# EAGLE design BlueHat2018 Ver 2.3A (EAGLE 7.6.0)
REV: 3
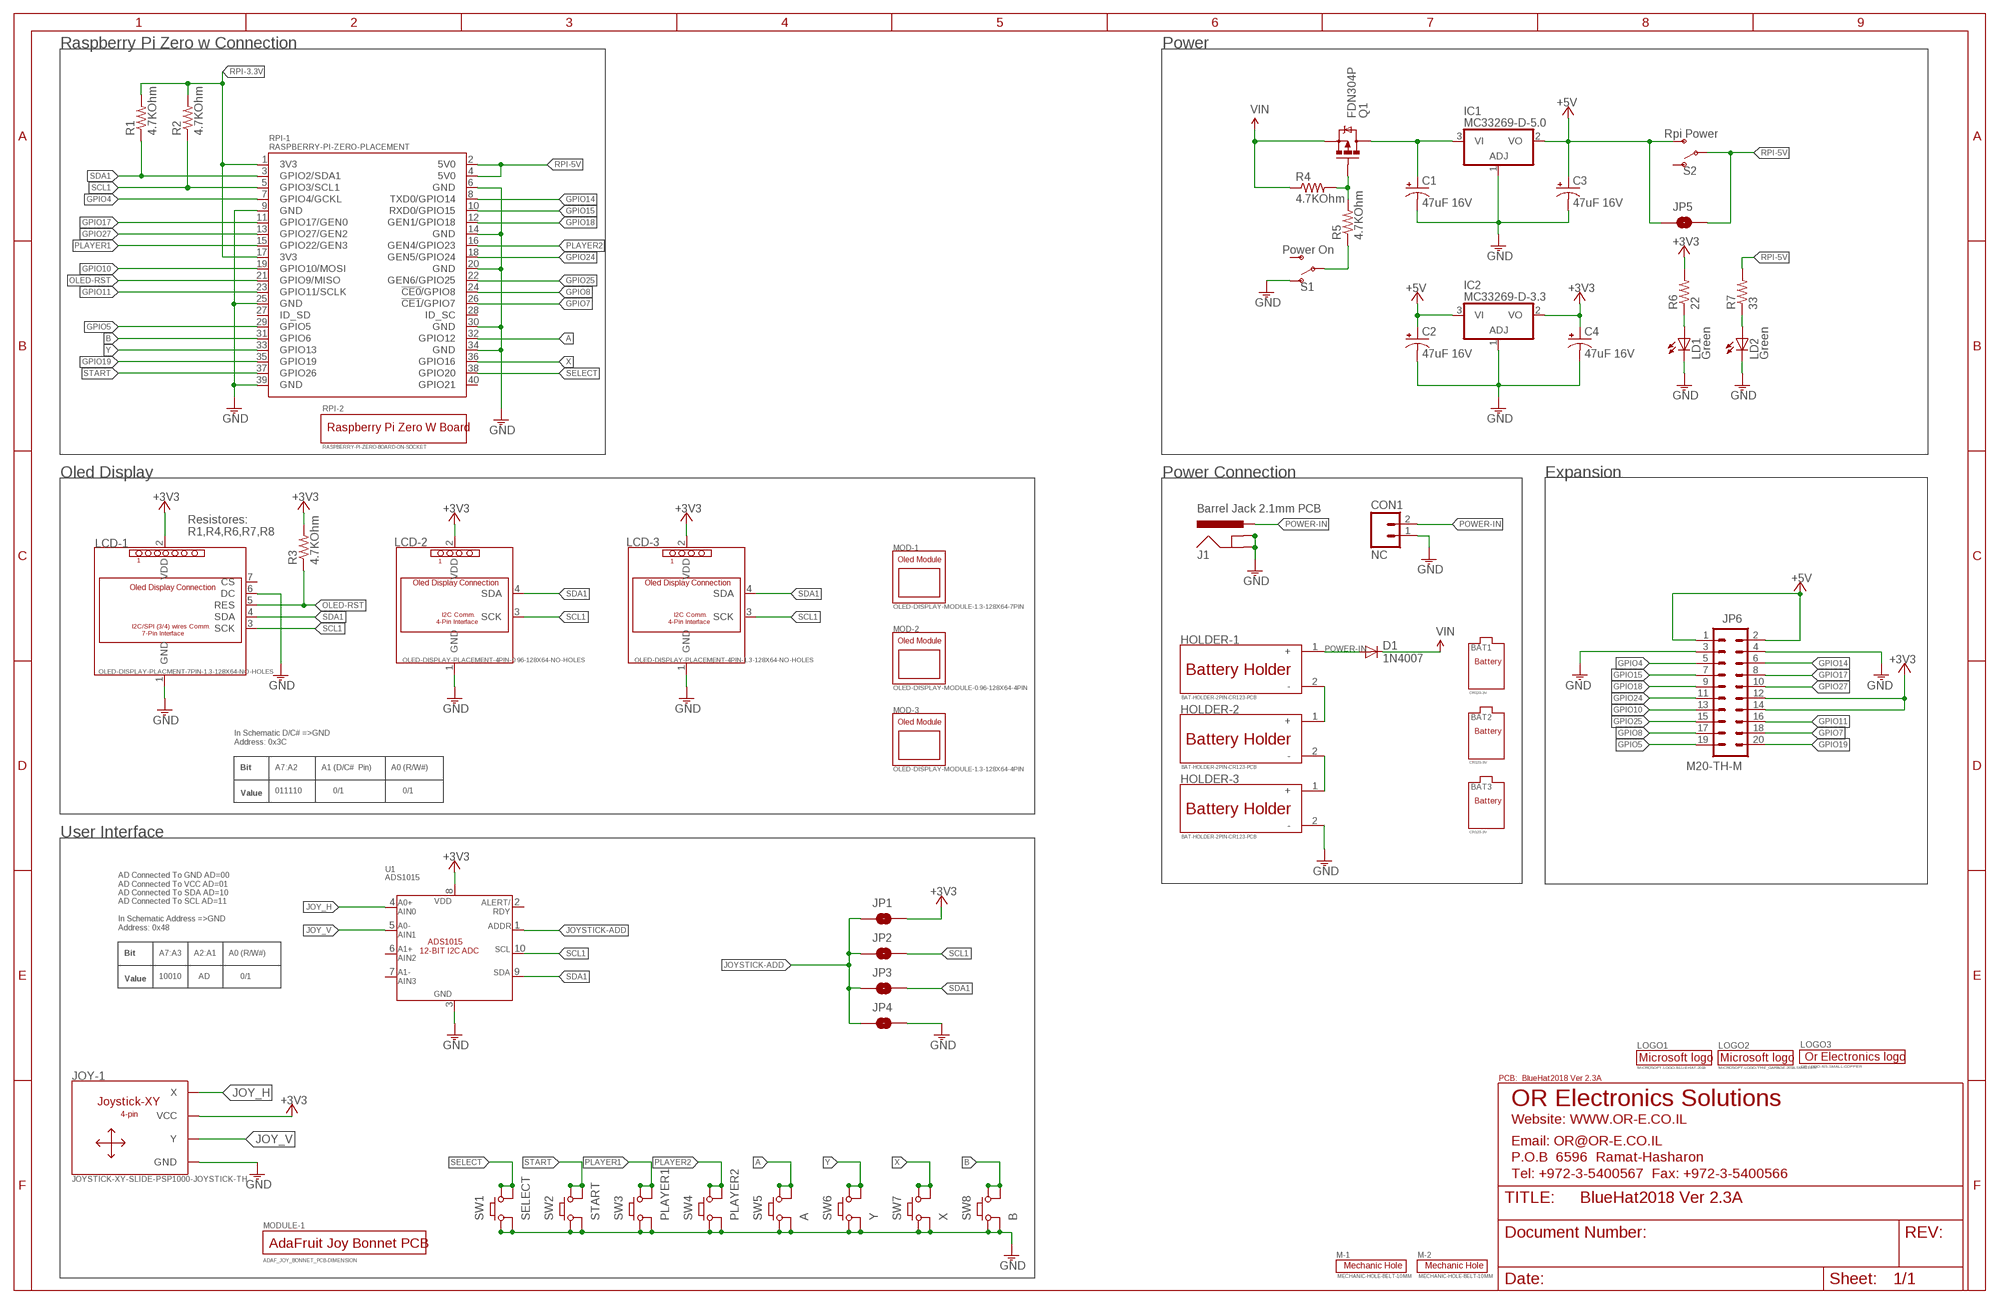
[diagram p0: schematic, sheet 1]

## Parts
BAT1  CR123-3V  BATTERY-CR123-3V  [CR123-BATTERY]
BAT2  CR123-3V  BATTERY-CR123-3V  [CR123-BATTERY]
BAT3  CR123-3V  BATTERY-CR123-3V  [CR123-BATTERY]
C1  47uF 16V  CAP_POLARIZEDD  [PANASONIC_D]
C2  47uF 16V  CAP_POLARIZEDD  [PANASONIC_D]
C3  47uF 16V  CAP_POLARIZEDD  [PANASONIC_D]
C4  47uF 16V  CAP_POLARIZEDD  [PANASONIC_D]
CON1  NC  M02-2PIN-MALE-2.54MM  [1X02-TH-M]
D1  1N4007  DIODEDO214AC  [DO214AC]
FRAME1  FRAME_B_L-TDOC  [PCB_DRAW_NAME_TDOC]
HOLDER-1  BAT-HOLDER-2PIN-CR123-PCB  [BAT-CR123-HOLDER]
HOLDER-2  BAT-HOLDER-2PIN-CR123-PCB  [BAT-CR123-HOLDER]
HOLDER-3  BAT-HOLDER-2PIN-CR123-PCB  [BAT-CR123-HOLDER]
IC1  MC33269-D-5.0  [DPACK]
IC2  MC33269-D-3.3  [DPACK]
J1  Barrel Jack 2.1mm PCB  POWER_JACKPTH_LOCK  [POWER_JACK_PTH_LOCK]
JOY-1  JOYSTICK-XY-SLIDE-PSP1000-JOYSTICK-TH  [JOYSTICK-PSP1000-TH]
JP1  JUMPER-2-POSITION-SMD-NO  [SJ_2S-NO]
JP2  JUMPER-2-POSITION-SMD-NO  [SJ_2S-NO]
JP3  JUMPER-2-POSITION-SMD-NO  [SJ_2S-NO]
JP4  JUMPER-2-POSITION-SMD-NC-TRACE-SMALL  [SJ_2S-TRACE-SMALL]
JP5  JUMPER-2-POSITION-SMD-NO  [SJ_2S-NO]
JP6  M20-TH-M  [2X10-TH-M]
LCD-1  OLED-DISPLAY-PLACMENT-7PIN-1.3-128X64-NO-HOLES  [OLED-1.3-7PIN-NO-HOLES]
LCD-2  OLED-DISPLAY-PLACEMENT-4PIN-0.96-128X64-NO-HOLES  [OLED-0.96-4PIN-NO-HOLES]
LCD-3  OLED-DISPLAY-PLACEMENT-4PIN-1.3-128X64-NO-HOLES  [OLED-1.3-4PIN-NO-HOLES]
LD1  Green  LED0603  [LD0603]
LD2  Green  LED0603  [LD0603]
LOGO1  MICROSOFT-LOGO-BLUEHAT-2018  [MICROSOFT_LOGO1_2018]
LOGO2  MICROSOFT-LOGO-THE_GARAGE-2018-SMALLER  [MICROSOFT_LOGO2_2018_SMALLER]
LOGO3  OR-LOGO-NS-SMALL-COPPER  [OR_LOGO-NS-SMALL-COPPER]
M-1  MECHANIC-HOLE-BELT-10MM  [BELT-10MM]
M-2  MECHANIC-HOLE-BELT-10MM  [BELT-10MM]
MOD-1  OLED-DISPLAY-MODULE-1.3-128X64-7PIN  [OLED-MODULE-1.3-128X64-7PIN]
MOD-2  OLED-DISPLAY-MODULE-0.96-128X64-4PIN  [OLED-MODULE-0.96-128X64-4PIN]
MOD-3  OLED-DISPLAY-MODULE-1.3-128X64-4PIN  [OLED-MODULE-1.3-128X64-4PIN]
MODULE-1  ADAF_JOY_BONNET_PCB-DIMENSION  [ADAF_JOY_BONNET_DIMENSION.]
Q1  FDN304P  MOSFET-PCHANNEL-SOT23  [SOT23]
R1  4.7KOhm  RESISTOR-SMD-0805  [R0805]
R2  4.7KOhm  RESISTOR-SMD-0805  [R0805]
R3  4.7KOhm  RESISTOR-SMD-0805  [R0805]
R4  4.7KOhm  RESISTOR-SMD-0805  [R0805]
R5  4.7KOhm  RESISTOR-SMD-0805  [R0805]
R6  22  RESISTOR-SMD-0805  [R0805]
R7  33  RESISTOR-SMD-0805  [R0805]
RPI-1  RASPBERRY-PI-ZERO-PLACEMENT  [RPI_ZERO_BOARD_PLACEMENT]
RPI-2  RASPBERRY-PI-ZERO-BOARD-ON-SOCKET  [RASPBERRY-PI-ZERO-BOARD-ON-SOCKET]
S1  Power On  SWITCH-SPDT-SSSS820201  [ALPS-SSSS820201]
S2  Rpi Power  SWITCH-SPDT-SSSS820201  [ALPS-SSSS820201]
SW1  SELECT  TAC_SWITCH-T.H.-6X6MM  [TACTILE-6X6-PTH]
SW2  START  TAC_SWITCH-T.H.-6X6MM  [TACTILE-6X6-PTH]
SW3  PLAYER1  TAC_SWITCH-T.H.-6X6MM  [TACTILE-6X6-PTH]
SW4  PLAYER2  TAC_SWITCH-T.H.-6X6MM  [TACTILE-6X6-PTH]
SW5  A  TAC_SWITCH-T.H.-6X6MM  [TACTILE-6X6-PTH]
SW6  Y  TAC_SWITCH-T.H.-6X6MM  [TACTILE-6X6-PTH]
SW7  X  TAC_SWITCH-T.H.-6X6MM  [TACTILE-6X6-PTH]
SW8  B  TAC_SWITCH-T.H.-6X6MM  [TACTILE-6X6-PTH]
U1  ADS1015  ADS1015-MSOP10  [MSOP10]

## Nets
+3V3 [power_1A]: C4.+ IC2.2(VO) JOY-1.VCC JOY-1.VCC@1(VCC) JP1.2 JP6.12 JP6.14 LCD-1.2(VDD) LCD-2.2(VDD) LCD-3.2(VDD) R3.2 R6.2 U1.8(VDD)
+5V [power_1A]: C2.+ C3.+ IC1.2(VO) IC2.3(VI) JP5.1 JP6.1 JP6.2 S2.3(T2)
A: RPI-1.32(GPIO12) SW5.3 SW5.4
B: RPI-1.31(GPIO6) SW8.3 SW8.4
GND: C1.- C2.- C3.- C4.- CON1.1 HOLDER-3.2(-) IC1.1(ADJ) IC2.1(ADJ) J1.GND J1.GNDBREAK JOY-1.GND JOY-1.GND@1(GND) JP4.2 JP6.3 JP6.4 LCD-1.1(GND) LCD-1.6(DC) LCD-2.1(GND) LCD-3.1(GND) LD1.C LD2.C S1.1(T1) SW1.1 SW1.2 SW2.1 SW2.2 SW3.1 SW3.2 SW4.1 SW4.2 SW5.1 SW5.2 SW6.1 SW6.2 SW7.1 SW7.2 SW8.1 SW8.2 U1.3(VSS)
GND@3: RPI-1.9(GND) RPI-1.25(GND) RPI-1.39(GND) ; supply symbol labelled GND
GND@7: RPI-1.6(GND) RPI-1.14(GND) RPI-1.20(GND) RPI-1.30(GND) RPI-1.34(GND) ; supply symbol labelled GND
GPIO4: JP6.5 RPI-1.7(GPIO4/GCKL)
GPIO5: JP6.19 RPI-1.29(GPIO5)
GPIO7: JP6.18 RPI-1.26(!CE1!/GPIO7)
GPIO8: JP6.17 RPI-1.24(!CE0!/GPIO8)
GPIO10: JP6.13 RPI-1.19(GPIO10/MOSI)
GPIO11: JP6.16 RPI-1.23(GPIO11/SCLK)
GPIO14: JP6.6 RPI-1.8(TXD0/GPIO14)
GPIO15: JP6.7 RPI-1.10(RXD0/GPIO15)
GPIO17: JP6.8 RPI-1.11(GPIO17/GEN0)
GPIO18: JP6.9 RPI-1.12(GEN1/GPIO18)
GPIO19: JP6.20 RPI-1.35(GPIO19)
GPIO24: JP6.11 RPI-1.18(GEN5/GPIO24)
GPIO25: JP6.15 RPI-1.22(GEN6/GPIO25)
GPIO27: JP6.10 RPI-1.13(GPIO27/GEN2)
JOY_H: JOY-1.X JOY-1.X@1(X) U1.4(AIN0)
JOY_V: JOY-1.Y JOY-1.Y@1(Y) U1.5(AIN1)
JOYSTICK-ADD: JP1.1 JP2.1 JP3.1 JP4.1 U1.1(ADDR)
N$1 [power_2A]: HOLDER-1.2(-) HOLDER-2.1(+)
N$2 [power_2A]: C1.+ IC1.3(VI) Q1.3(D)
N$3: Q1.1(G) R4.2 R5.2
N$4: LD1.A R6.1
N$5: LD2.A R7.1
N$6: R5.1 S1.2(P)
N$7 [power_2A]: HOLDER-2.2(-) HOLDER-3.1(+)
OLED-RST: LCD-1.5(RES) R3.1 RPI-1.21(GPIO9/MISO)
PLAYER1: RPI-1.15(GPIO22/GEN3) SW3.3 SW3.4
PLAYER2: RPI-1.16(GEN4/GPIO23) SW4.3 SW4.4
POWER-IN [power_2A]: CON1.2 D1.A HOLDER-1.1(+) J1.PWR
RPI-3.3V: R1.2 R2.2 RPI-1.1(3V3) RPI-1.17(3V3)
RPI-5V [power_1A]: JP5.2 R7.2 RPI-1.2(5V0) RPI-1.4(5V0) S2.2(P)
SCL1: JP2.2 LCD-1.3(SCK) LCD-2.3(SCK) LCD-3.3(SCK) R2.1 RPI-1.5(GPIO3/SCL1) U1.10(SCL)
SDA1: JP3.2 LCD-1.4(SDA) LCD-2.4(SDA) LCD-3.4(SDA) R1.1 RPI-1.3(GPIO2/SDA1) U1.9(SDA)
SELECT: RPI-1.38(GPIO20) SW1.3 SW1.4
START: RPI-1.37(GPIO26) SW2.3 SW2.4
VIN [power_2A]: D1.C Q1.2(S) R4.1
X: RPI-1.36(GPIO16) SW7.3 SW7.4
Y: RPI-1.33(GPIO13) SW6.3 SW6.4
Unconnected: LCD-1.7(CS) RPI-1.27(ID_SD) RPI-1.28(ID_SC) RPI-1.40(GPIO21) S1.3(T2) S2.1(T1) U1.2(ALERT/RDY) U1.6(AIN2) U1.7(AIN3)

## Notes on the sheet
- Raspberry Pi Zero w Connection | Power
- Oled Display | Power Connection | Expansion
- Resistores: 
  R1,R4,R6,R7,R8
- In Schematic D/C# =>GND
  Address: 0x3C
- Bit | A7:A2 | A1 (D/C#  Pin) | A0 (R/W#)
- 011110 | 0/1 | 0/1
- Value
- User Interface
- AD Connected To GND AD=00
  AD Connected To VCC AD=01
  AD Connected To SDA AD=10
  AD Connected To SCL AD=11
  
  In Schematic Address =>GND
  Address: 0x48
- Bit | A7:A3 | A2:A1 | A0 (R/W#)
- 10010 | AD | 0/1
- Value

## Library data of the parts
BAT1-BAT3 = Or-Library:BATTERY: Battery No Footprint for it
C1-C4 = Or-Library:CAP_POLARIZED: Capacitor Polarized These are standard SMD capacitors. Normally 10uF, 47uF, and 100uF in electrolytic and tantalum varieties. Always verify the external diameter of the through hole cap, it varies with capacity, voltage, and manufacturer. The EIA devices should be standard.
CON1 = Or-Library:M02: Header 2 Standard 2-pin 0.1" header. Use with straight break away headers (SKU : PRT-00116), right angle break away headers (PRT-00553), swiss pins (PRT-00743), machine pins (PRT-00117), and female headers (PRT-00115). Molex polarized connector foot print use with SKU : PRT-08233 with associated crimp pins and housings.
D1 = Or-Library:DIODE: DIODE
FRAME1 = Or-Library:FRAME_B_L: FRAME B Size , 11 x 17 INCH, Landscape
HOLDER-1-HOLDER-3 = Or-Library:BAT-HOLDER-2PIN: Battery Holder Holder For Battery
IC1 IC2 = Or-Library:MC33269?*: Adjustable Output Low Dropout Voltage Regulator 800 mA Source: http://www.onsemi.com/pub/Collateral/MC33269-D.PDF
J1 = Or-Library:POWER_JACK: Power Jack This is the standard 5.5mm barrel jack for power. The PTH is the most common, proven, reliable, footprint. All others are experimental. The Slot footprint only works if the mill layer is transmitted to the PCB fab house so be warned. Spark Fun Electronics SKU : PRT-00119. Mating wall wart : TOL-00298 (and others)
JOY-1 = Or-Library:JOYSTICK-XY-SLIDE: Resistive Slide Joystick Rresistive analog joystick
JP1-JP5 = Or-Library:JUMPER-2-POSITION: Jumper Basic spaced jumper SMD or TH please refer package type
JP6 = Or-Library:M20: Header 20pin Header with 20 connections Male/Female Please refer Package
LCD-1 = Or-Library:OLED-DISPLAY-PLACMENT-7PIN: Oled Connection Connection of Oled Module to the pcb soldering on pcb Or On Socket
LCD-2 LCD-3 = Or-Library:OLED-DISPLAY-PLACEMENT-4PIN: Oled Connection Connection of Oled Module to the pcb soldering on pcb Or On Socket
LD1 LD2 = Or-Library:LED: LED Standard schematic elements and footprints for 5mm, 3mm, 1206, and 0603 sized LEDs.
LOGO1 LOGO2 = Or-Library:MICROSOFT-LOGO: Logo Text On Pcb No Footprint
LOGO3 = Or-Library:OR-LOGO: Logo Text On Pcb No Footprint
M-1 M-2 = Or-Library:MECHANIC-HOLE: Mechanic Hole No Footprint
MOD-1-MOD-3 = Or-Library:OLED-DISPLAY-MODULE: OLED Display Module I2C Communication 4-pin or 7-pin No Footprint (Please Refer Item Value)
MODULE-1 = Or-Library:ADAF_JOY_BONNET_PCB
Q1 = Or-Library:MOSFET-PCHANNEL: Mosfet P-Channel
R1-R7 = Or-Library:RESISTOR: Resistor Basic schematic elements and footprints for 0805, 0603, 1206, and PTH resistors.; PRICE1: 0.004; SUP1: Ali
RPI-1 = Or-Library:RASPBERRY-PI-ZERO: Rasppberry Pi GPIO Header Female Header - 2x20 - 2.54mm pitch
RPI-2 = Or-Library:RASPBERRY-PI-ZERO-BOARD: Raspberry Pi Zero Module of Raspberry Pi Zero - No Footprint
S1 S2 = Or-Library:SWITCH-SPDT: Single Pole, Double Throw (SPDT) Switch Single-pole, double-throw (SPDT) switch. Variant Overview SMD-AYZ0202 Surface Mount DPDT Switch <https://www.sparkfun.com/products/597> (COM-00597) Used on e.g. LilyPad Arduino USB - ATmega32U4 Board <https://www.sparkfun.com/products/12049> PTH-11.6X4.0MM SPDT Mini Power Switch <https://www.sparkfun.com/products/102> (COM-00102) Used on e.g. SparkFun Simon Says - Through-Hole Soldering Kit <https://www.sparkfun.com/products/10547> (KIT-10547) PTH-11.6X4.0MM-KIT KIT version of SPDT Mini Power Switch - Simplifies soldering by removing tStop of switch pins - only one side can be soldered. PTH-11.6X4.0MM-LOCK LOCK version of SPDT Mini Power Switch - Offset pins hold switch in place for easier soldering. SMD-RIGHT-ANGLE Surface Mount Right Angle Switch <https://www.sparkfun.com/products/10860> (COM-10860) Used on e.g. SparkFun ESP8266 Thing <https://www.sparkfun.com/products/13231>
SW1-SW8 = Or-Library:TAC_SWITCH: Momentary pushbutton Switch Tactile Switch - Please refer package
U1 = Or-Library:ADS1015: ADS1015 12-BIT ADC 12-Bit Del-Sig ADC Four single-ended inputs or two differential inputs Internal PGA I2C interface 2.0-5.5V; PROD_ID: IC-12270

## Net classes
1 power_1A: width 0.508 mm, drill 0.508 mm, clearance 0.508 mm
2 power_2A: width 0.889 mm, drill 0.889 mm, clearance 0.889 mm

## Board
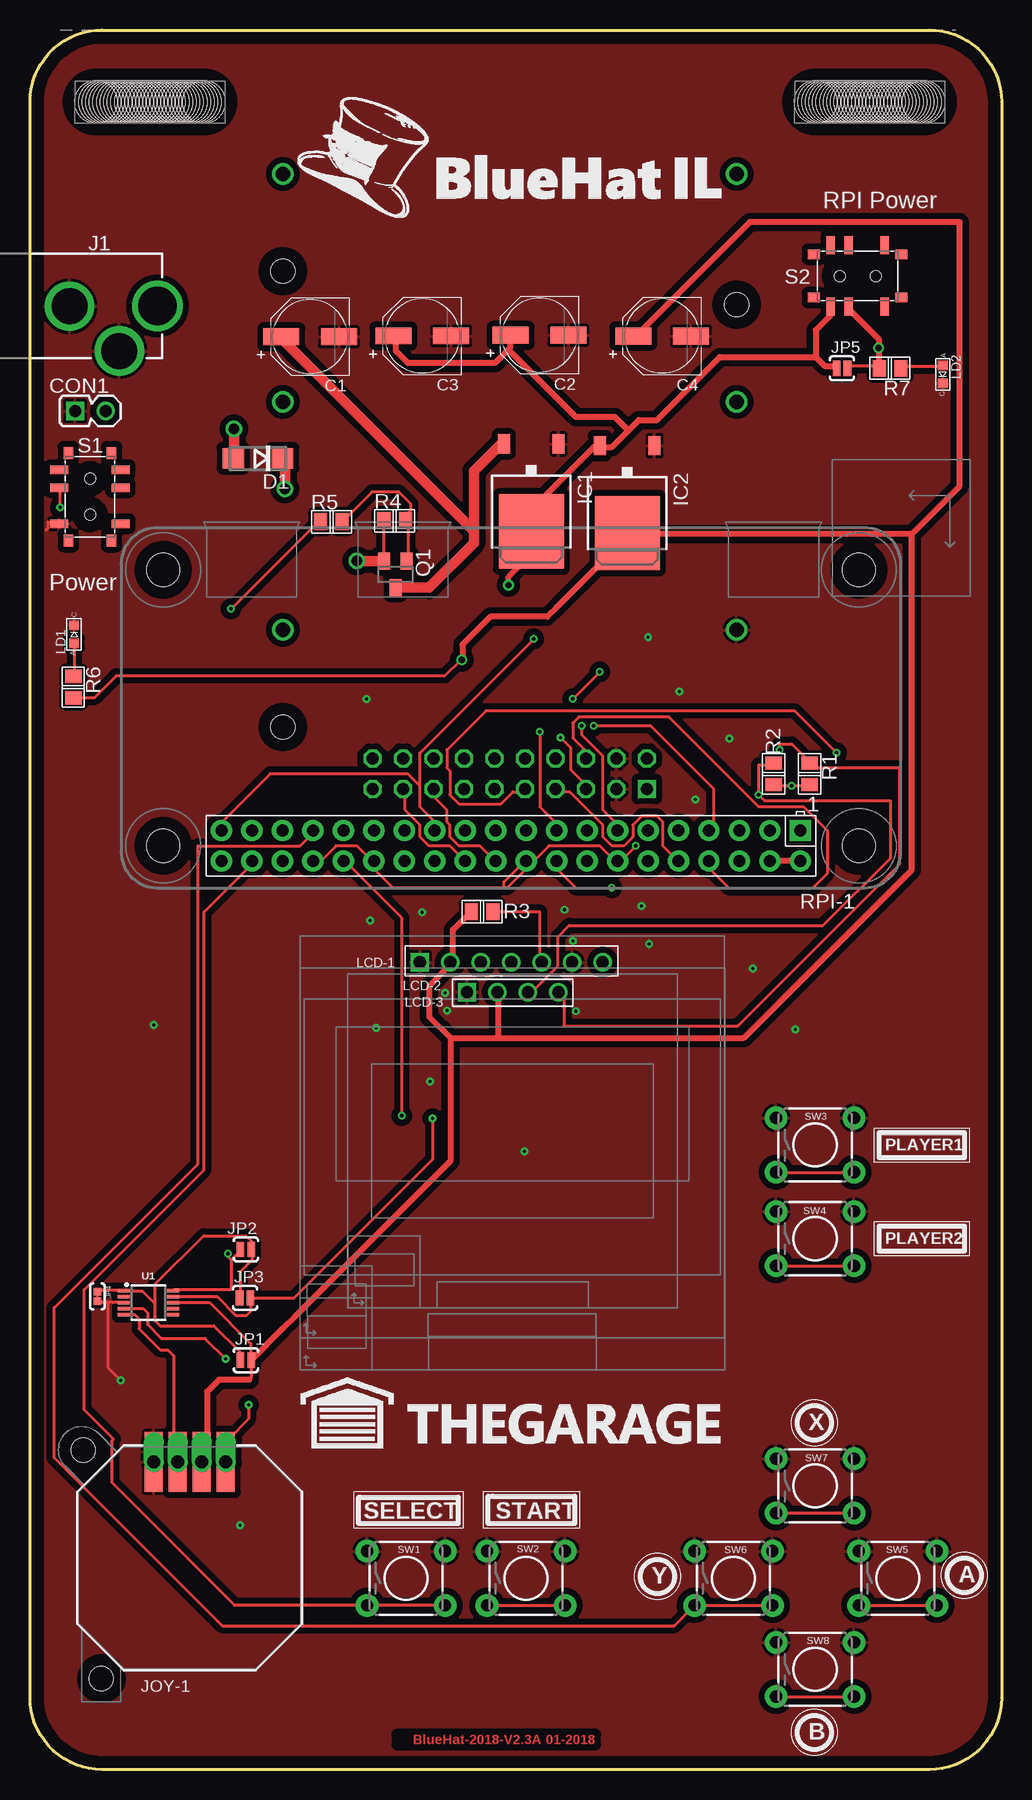
[diagram p1: board, top side]
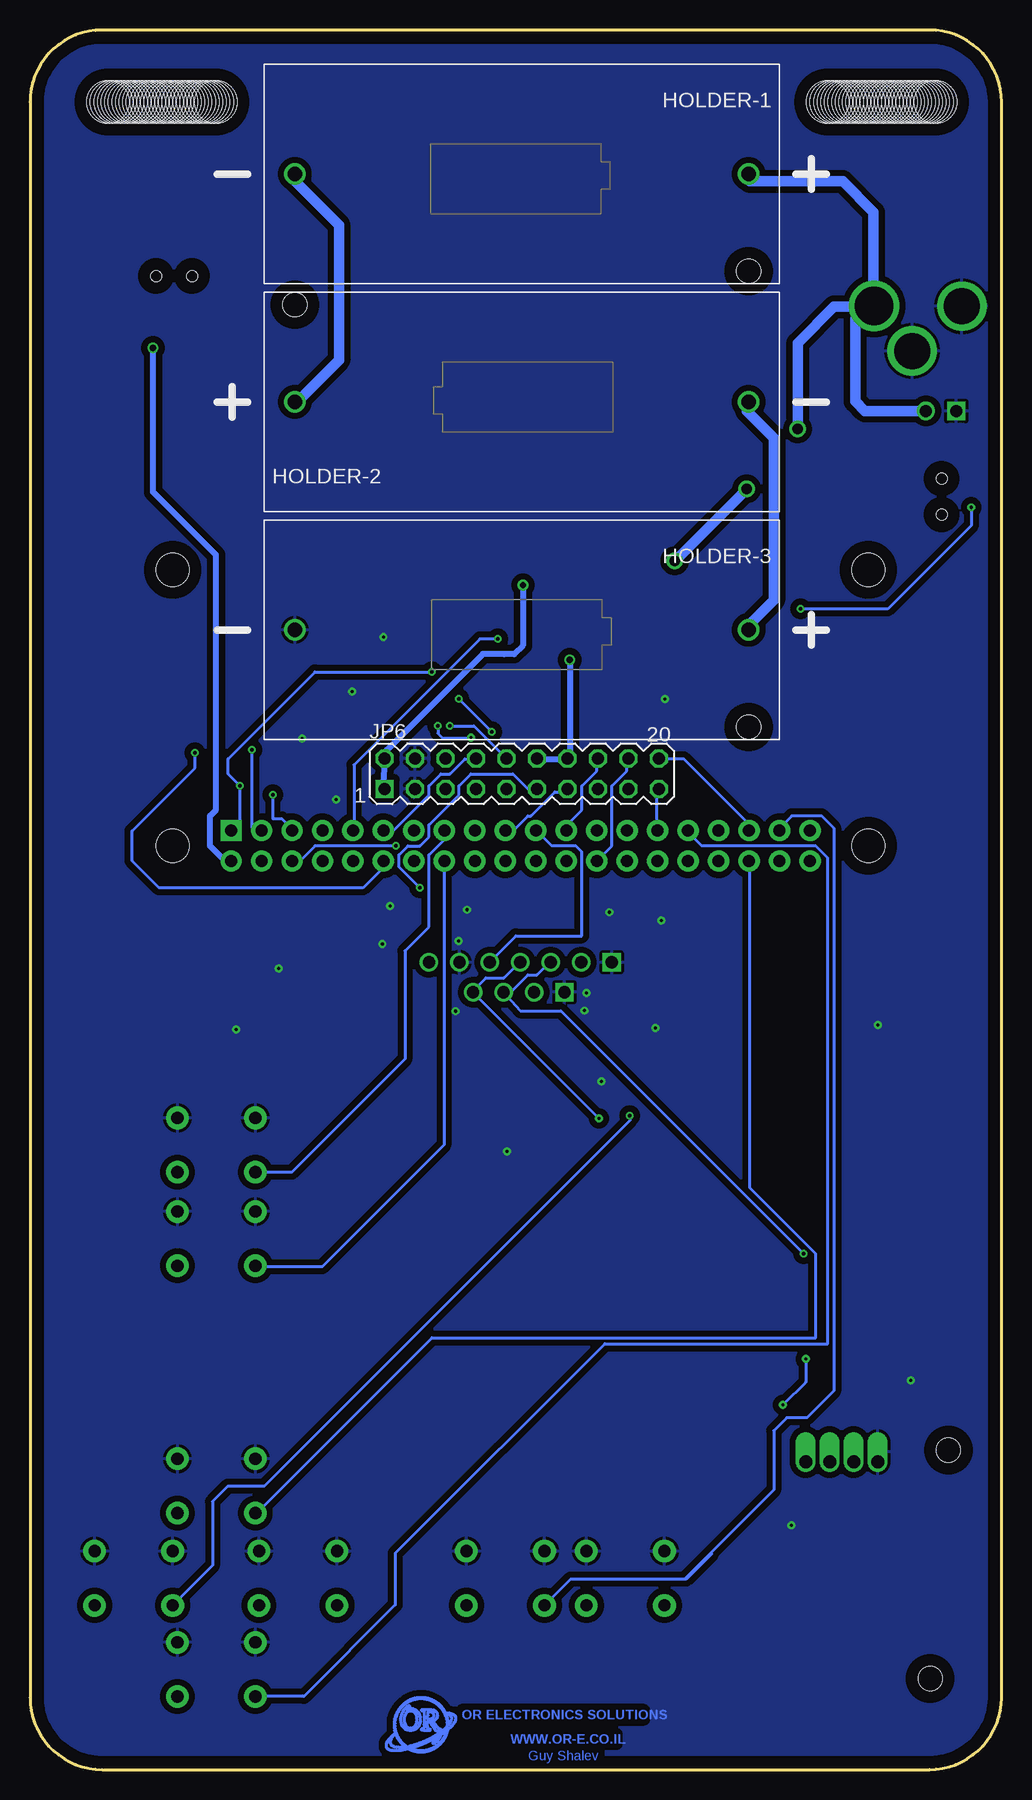
[diagram p2: board, bottom side, seen from below]

Size 81 x 145 mm. Coordinates in mm from the lower left corner, seen from the top.
Outline: 6,145 75,145 arc-90 81,139 81,6 arc-90 75,0 6,0 arc-90 0,6 0,139 arc-90 6,145
Copper layers (1*16): Top 0.035mm / dielectric 1.5mm / Bottom 0.035mm
Design rules "default *": minimum track width 10mil, minimum drill 10mil, track to track 8mil, track to pad 8mil, pad to pad 8mil, via to via 8mil, smd to smd 8mil, copper to edge 40mil, drill to drill 8mil, minimum pad ring 10mil, minimum via ring 8mil, stop-mask expansion 10mil, vias tented up to drill 0mil, thermal gap 10mil

### Footprints (pad centres in the part's own frame; a part is rotated, then mirrored left to right if it is on the bottom)
PANASONIC_D = smd 3 x 1.4: + 2.4,0; - -2.4,0
1X02-TH-M = drill 1.016 square: 1 -1.27,0 | drill 1.016: 2 1.27,0
DO214AC = smd 1.8 x 1.7: A 2.05,0; C -2.05,0
BAT-CR123-HOLDER = drill 1.2: 1 -18.91,0; 2 18.91,0 | hole 2: -18.91,8.1
DPACK = smd 1 x 1.6: 1 -2.28,-4.8; 3 2.28,-4.8 | smd 5.4 x 6.2: 2 0,2.5
POWER_JACK_PTH_LOCK = drill 2.997 pad 4.115: GND 0.025,6.557; GNDBREAK 3.762,10.7 | drill 3.2 pad 4.115: PWR 0,13.878
JOYSTICK-PSP1000-TH = smd 1.5 x 5: GND -3,8; VCC 1,8; X 3,8; Y -1,8 | drill 1.1 pad 1.4 offset: GND@1 -3,8; VCC@1 1,8; X@1 3,8; Y@1 -1,8 | hole 2: -8.89,8.985; -7.375,-10.06
SJ_2S-NO = smd 0.635 x 1.27: 1 -0.45,0; 2 0.45,0
SJ_2S-TRACE-SMALL = smd 0.635 x 0.635: 1 -0.408,0; 2 0.408,0
2X10-TH-M = drill 1.016 square: 1 -11.43,-1.27 | drill 1.016 octagon: 2 -11.43,1.27; 3 -8.89,-1.27; 4 -8.89,1.27; 5 -6.35,-1.27; 6 -6.35,1.27; 7 -3.81,-1.27; 8 -3.81,1.27; 9 -1.27,-1.27; 10 -1.27,1.27; 11 1.27,-1.27; 12 1.27,1.27; 13 3.81,-1.27; 14 3.81,1.27; 15 6.35,-1.27; 16 6.35,1.27; 17 8.89,-1.27; 18 8.89,1.27; 19 11.43,-1.27; 20 11.43,1.27
OLED-1.3-7PIN-NO-HOLES = drill 1.016 square: 1 10,31.29 | drill 1.016: 2 12.54,31.29; 3 15.08,31.29; 4 17.62,31.29; 5 20.16,31.29; 6 22.7,31.29; 7 25.24,31.29
OLED-0.96-4PIN-NO-HOLES = drill 1.016 square: 1 9.933,26.294 | drill 1.016: 2 12.473,26.294; 3 15.013,26.294; 4 17.553,26.294
OLED-1.3-4PIN-NO-HOLES = drill 1.016 square: 1 13.89,31.5 | drill 1.016: 2 16.43,31.5; 3 18.97,31.5; 4 21.51,31.5
LD0603 = smd 0.8 x 0.8: A 0,-0.75; C 0,0.75
BELT-10MM = hole 3.5: 0,0; -0.3,0; -0.6,0; -0.9,0; -1.2,0; -1.5,0; -1.8,0; -2.1,0; -2.4,0; -2.7,0; -3,0; -3.3,0; -3.6,0; -3.9,0; -4.2,0; -4.5,0; 0.3,0; 0.6,0; 0.9,0; 1.2,0; 1.5,0; 1.8,0; 2.1,0; 2.4,0; 2.7,0; 3,0; 3.3,0; 3.6,0; 3.9,0; 4.2,0; 4.5,0
SOT23 = smd 1 x 1.4: 1 -0.95,-1.1; 2 0.95,-1.1; 3 0,1.1
R0805 = smd 1.1 x 1.4: 1 -0.9,0; 2 0.9,0
RPI_ZERO_BOARD_PLACEMENT = drill 1 pad 1.778 square: 1 8.37,25.23 | drill 1 pad 1.778: 2 8.37,27.77; 3 10.91,25.23; 4 10.91,27.77; 5 13.45,25.23; 6 13.45,27.77; 7 15.99,25.23; 8 15.99,27.77; 9 18.53,25.23; 10 18.53,27.77; 11 21.07,25.23; 12 21.07,27.77; 13 23.61,25.23; 14 23.61,27.77; 15 26.15,25.23; 16 26.15,27.77; 17 28.69,25.23; 18 28.69,27.77; 19 31.23,25.23; 20 31.23,27.77; 21 33.77,25.23; 22 33.77,27.77; 23 36.31,25.23; 24 36.31,27.77; 25 38.85,25.23; 26 38.85,27.77; 27 41.39,25.23; 28 41.39,27.77; 29 43.93,25.23; 30 43.93,27.77; 31 46.47,25.23; 32 46.47,27.77; 33 49.01,25.23; 34 49.01,27.77; 35 51.55,25.23; 36 51.55,27.77; 37 54.09,25.23; 38 54.09,27.77; 39 56.63,25.23; 40 56.63,27.77 | hole 2.75: 3.5,3.5; 3.5,26.5; 61.5,3.5; 61.5,26.5
ALPS-SSSS820201 = smd 0.7 x 1.5: 1 -2.25,2.55; 2 0.75,2.55; 3 2.25,2.55; 4 -2.25,-2.55; 5 0.75,-2.55; 6 2.25,-2.55 | smd 1 x 0.8: M1 -3.65,1.8; M2 -3.65,-1.8; M4 3.65,-1.8; P$2 3.65,1.8 | hole 0.9: -1.5,0; 1.5,0
TACTILE-6X6-PTH = drill 1.016 pad 1.88: 1 -3.251,2.261; 2 3.251,2.261; 3 -3.251,-2.261; 4 3.251,-2.261
MSOP10 = smd 0.3 x 1: 1 -1,-2.05; 2 -0.5,-2.05; 3 0,-2.05; 4 0.5,-2.05; 5 1,-2.05; 6 1,2.05; 7 0.5,2.05; 8 0,2.05; 9 -0.5,2.05; 10 -1,2.05

### Placement (x,y rotation side)
BAT1  39.9,95 180 bottom
BAT2  40,114 0 bottom
BAT3  40,133 180 bottom
C1  23.36,119.43 180 top
C2  42.48,119.55 180 top
C3  32.7,119.49 180 top
C4  52.7,119.49 180 top
CON1  5.03,113.24 0 top
D1  19,109.3 180 top
FRAME1  3.2,-2.18 0 top
HOLDER-1  40,133 180 bottom
HOLDER-2  40,114 0 bottom
HOLDER-3  40,95 180 bottom
IC1  41.8,105.7 180 top
IC2  49.8,105.56 180 top
J1  -3.25,122 270 top
JOY-1  13.32,17.64 0 top
JP1  18,34.12 0 top
JP2  18,43.35 180 top
JP3  17.93,39.31 0 top
JP4  5.62,39.43 270 top
JP5  67.69,116.8 0 top
JP6  40,83 0 bottom
LCD-1  22.5,36 0 top
LCD-2  26.5,38.5 0 top
LCD-3  22.54,33.3 0 top
LD1  3.67,94.63 0 top
LD2  76.1,116.3 180 top
LOGO1  21.9,128.9 0 top
LOGO2  22.6,26.8 0 top
LOGO3  51.31,1.87 0 bottom
M-1  70,139 0 top
M-2  10,139 0 top
MOD-1  22.5,36 0 top
MOD-2  26.5,38.5 0 top
MOD-3  22.54,33.3 0 top
MODULE-1  -10,-43.1 0 top  (outside the outline)
Q1  30.46,99.63 180 top
R1  65,83 270 top
R2  62,83 270 top
R3  37.7,71.5 180 top
R4  30.4,104.1 0 top
R5  25.13,104.02 0 top
R6  3.62,90.23 270 top
R7  71.7,116.8 180 top
RPI-1  72.6,103.5 180 top
RPI-2  72.6,103.5 180 top
S1  5,106.1 90 top
S2  69,124.5 180 top
SW1  31.36,15.94 0 top
SW2  41.36,15.94 0 top
SW3  65.46,52.05 0 top
SW4  65.46,44.25 0 top
SW5  72.36,15.94 0 top
SW6  58.66,15.94 0 top
SW7  65.46,23.64 0 top
SW8  65.46,8.34 0 top
U1  9.87,38.92 270 top

### Tracks (layer width: path | path; a pad name or v marks a point on that pad's centre or on a via)
+3V3  (via drill 0.51)
  Top 0.254: 18.3,32.5 18.45,32.65 JP1.2 18.4,34.17 18.4,35.5 14.98,38.92 U1.8 | 35.91,92.41 35.84,92.41 34.58,91.15 7.18,91.15 5.35,89.32 R6.2
  Top 0.508: 73.5,103 50,103 IC2.2 | 73.5,103 73.5,75 59.5,61 39,61 | 39,61 39,64.5 LCD-2.2 39,65 LCD-3.2 | R3.2 36.75,71.5 35.25,70 35.25,67.5 LCD-1.2 35.04,67.04 33.27,65.28 33.27,62.74 35.05,60.96 | 18.3,32.5 15.75,32.5 14.75,31.5 14.75,26.07 JOY-1.VCC@1 | 49.5,103 IC2.2 | 73.5,103 77.5,107 77.5,129 60,129 50.5,119.5 C4.+ | IC2.2 49.25,103 49,103 49,101.99 43.92,96.91 43.92,96.9 43.11,96.09 38.39,96.09 36.06,93.76 36.06,92.56 v36,92.5 | v36,92.5 36,92.75 | 35.91,92.41 v36,92.5 | 35.05,60.96 38.96,60.96 39,61 | 35.05,60.96 35.05,50.73 22.07,37.74 21.08,36.76 JP1.2
  Bottom 0.508: JP6.14 36.25,84.25 38.5,84.25 JP6.12 | 36,84.5 JP6.14 | v36,92.5 36,84.75 JP6.14
+5V  (via drill 0.51)
  Top 0.508: 39.88,118.38 40,118.5 40,119.5 C2.+ | 39.88,118.38 38.75,117.25 31.5,117.25 30.5,118.25 30.5,119.25 C3.+ | 65.5,117.75 66.25,117 67,117 JP5.1 | 65.5,117.75 65.5,120 66.75,121.25 S2.3 | 41.75,101 41.75,103 IC1.2 | IC1.2 42,103.25 42,105.25 47,110.25 47.5,110.25 IC2.3 47.75,110.25 48.5,110.25 49.88,111.62 | 65.5,117.75 57.5,117.75 52.25,112.5 50.75,112.5 49.88,111.62 | 39.88,118.38 45.5,112.75 48.75,112.75 49.88,111.62 | IC1.2 41.5,101 39.9,99.4 v39.9,98.72
  Bottom 0.508: v39.9,98.72 39.9,93.7 40.63,92.97 41.47,92.97 41.5,93 43.25,93 51.25,85 JP6.2 51.49,82 | 51.5,81.75 51.49,82 | JP6.1 51.5,82 51.49,82
A  (via drill 0.25)
  Top 0.254: v31,54.5 31,71 26.5,75.5 RPI-1.32 | SW5.3 SW5.4
  Bottom 0.254: v31,54.5 31,54.09 61.47,23.62 64.52,23.62 65.79,22.35 65.79,17 SW5.3
B
  Top 0.254: SW8.3 SW8.4
  Bottom 0.254: RPI-1.31 26,78 25,77 15.5,77 14.5,76 14.5,35.5 33.08,35.5 50.55,18.03 50.55,13.72 58.17,6.1 62.19,6.1 SW8.3
GND  (via drill 0.25)
  Top 0.254: 6.5,38.92 U1.3 6.89,38.92 | 6.5,38.92 5.72,38.92 JP4.2 | 6.5,38.92 6.5,33.5 7.5,32.5 v7.55,32.42 | 6.5,39 6.5,38.92 | S1.1 2,104 1.5,104 1.5,103.5 1.35,103.35
  other vias: 55.46,80.86 58.31,85.93 28.06,89.24 51.54,94.41 54.14,89.85 60.26,66.77 28.36,70.77 50.96,71.97 44.56,71.67 17.51,20.36 28.86,61.8 32.67,71.46 45.28,69.05 51.63,68.8 63.82,61.69 41.21,51.52 34.61,64.73 33.34,57.37 45.53,63.21 10.32,62.06 34.79,63.25
  pour Top (isolate 0.508): -7.4,145.9 86,145.9 86,-5 -7.4,-5
  pour Bottom (isolate 0.508): -10,146 86,146 86,-9 -10,-9
GND@3  (via drill 0.25)
  Top 0.254: 32.5,82 31.5,83 20,83 16,79 16,78.5 RPI-1.39 | 32.5,82 32.5,80.25 33.75,79 RPI-1.25 | v42,94.25 32.5,84.75 32.5,82
  Bottom 0.254: v42,94.25 43.5,94.25 54,83.75 54,78.5 RPI-1.9
GND@7  (via drill 0.25)
  Top 0.254: RPI-1.34 23.75,75.75 24.25,75.75 25.5,77 27.25,77 28.5,75.75 RPI-1.30 28.75,75.5 28.75,75 30.25,73.5 39.5,73.5 | v50.5,77 49,75.5 RPI-1.14 48.75,75.75 47.5,77 43.25,77 39.75,73.5 39.5,73.5 | 39.5,73.5 39.5,74 41,75.5 RPI-1.20
  Bottom 0.254: v50.5,77 57.25,77 58.5,75.75 59,75.75 RPI-1.6
GPIO4  (via drill 0.25)
  Top 0.254: v47,87 51.75,87 57,81.75 57,78.75 56.75,78.5 RPI-1.7 | JP6.5 46.35,82.07 45.09,83.33 45.09,85.16 v44.24,86.02
  Bottom 0.254: v47,87 47,86.36 46.62,85.98 44.27,85.98 v44.24,86.02
GPIO5
  Bottom 0.254: JP6.19 28.75,81.5 28.75,78.5 RPI-1.29
GPIO7
  Bottom 0.254: JP6.18 31.25,84.25 31.25,83.25 32.5,82 32.5,77 33.75,75.75 RPI-1.26
GPIO8
  Top 0.254: JP6.17 31.25,81.5 31.25,80 32.5,78.75 32.5,77.75 33.25,77 35,77 36.25,75.75 RPI-1.24
GPIO10
  Bottom 0.254: JP6.13 36.25,81.5 37.25,81.5 39.25,79.5 39.5,79.5 40.5,78.5 41.25,78.5 RPI-1.19
GPIO11
  Bottom 0.254: JP6.16 33.75,84.25 33.75,83.25 35,82 35,80 36.5,78.5 RPI-1.23
GPIO14
  Top 0.254: JP6.6 46.25,84.5 46.25,85 45.25,86 45.25,87.25 45.75,87.75 53.25,87.75 60.75,80.25 64.5,80.25 66.5,78.25 66.5,74.75 65.25,73.5 58.25,73.5 56.75,75 56.75,75.5 RPI-1.8
GPIO15
  Top 0.254: JP6.7 44,81.5 45,81.5 47.75,78.75 47.75,77.75 48.5,77 49.5,77 50.25,77.75 50.25,78.75 51,79.5 52.25,79.5 52.75,79 52.75,77 54,75.75 RPI-1.10
GPIO17
  Bottom 0.254: JP6.8 44,84.25 44.75,84.25 46,83 46.75,83 47.75,82 47.75,81.25 50.75,78.25 51.5,78.25 RPI-1.11
GPIO18  (via drill 0.25)
  Top 0.254: v67.25,84.75 63.75,88.25 38,88.25 34.75,85 34.75,83.5 35,83.25 35,81.25 35.75,80.5 39.25,80.5 40.25,81.5 41.25,81.5 JP6.9
  Bottom 0.254: v67.25,84.75 67.25,83.5 72.5,78.25 72.5,75.75 70.25,73.5 53.25,73.5 51.75,75 51.75,75.5 RPI-1.12
GPIO19
  Bottom 0.254: JP6.20 28.5,84.25 26.5,84.25 21.25,79 21.25,78.5 RPI-1.35
GPIO24  (via drill 0.25)
  Top 0.254: v48.5,73.5 45.5,73.5 44,75 44,75.5 RPI-1.18
  Bottom 0.254: v48.5,73.5 50.25,75.25 50.25,76.25 49.5,77 48.5,77 47.75,77.75 47.75,78.75 45.25,81.25 45.25,82 44.25,83 40.75,83 39.5,81.75 38.75,81.75 JP6.11
GPIO25
  Top 0.254: JP6.15 33.75,81.5 33.75,81 34.75,80 34.75,79 35,78.75 35,77.75 35.75,77 37.5,77 38.75,75.75 RPI-1.22
GPIO27  (via drill 0.25)
  Top 0.254: v46,87 46,86.25 47.75,84.5 47.75,80 48.75,79 48.75,78.5 RPI-1.13
  Bottom 0.254: JP6.10 44,87 v46,87
JOY_H  (via drill 0.25)
  Top 0.254: U1.4 9.43,38.42 9.8,38.04 9.8,37.1 10.95,35.95 14.58,35.95 v16.32,34.21 | JOY-1.X@1 16.5,27.5 18.23,29.23 v18.23,30.38
  Bottom 0.254: v16.32,34.21 16.32,32.29 v18.23,30.38
JOY_V
  Top 0.254: U1.5 8.72,37.92 9.1,37.54 9.1,36.74 10.85,34.99 11.47,34.99 11.98,34.48 12,34.5 12,26 JOY-1.Y@1
JOYSTICK-ADD
  Top 0.254: 8,40 U1.1 | JP3.1 17.5,39.5 17.5,41.5 18.5,42.5 18.5,43 JP2.1 18.5,43.5 18.5,44 18,44.5 14.48,44.5 10.44,40.46 10.44,38.81 | 10.44,38.81 10.44,37.4 10.85,37 15.31,37 17.47,34.84 17.47,34.2 JP1.1 | 10.44,38.81 9.38,39.87 7.86,39.87 U1.1 | U1.1 5.69,39.92 JP4.1
N$1
  Bottom 0.889: HOLDER-2.1 58.75,114 55.25,117.5 55.25,128.75 59,132.5 59,133 HOLDER-1.2
N$2
  Top 0.889: 37,103.5 37,108.25 39.25,110.5 39.5,110.5 IC1.3 | 30.5,98.5 Q1.3 30.47,98.52 33.29,98.52 37,102.23 37,103.5 | C1.+ 21,119.25 36.75,103.5 37,103.5
N$3
  Top 0.254: R5.2 26.25,104.25 28.5,106.5 30.75,106.5 31.75,105.5 31.75,105 31.5,104.75 31.5,104.25 R4.2 31.5,104 31.5,100.75 Q1.1
N$4
  Top 0.254: LD1.A 3.67,91.18 R6.1
N$5
  Top 0.254: LD2.A 76,117 72.75,117 R7.1
N$6  (via drill 0.25)
  Top 0.254: v16.75,96.75 24,104 R5.1 | 2.5,106.75 S1.2 2.51,106.79 v2.51,105.21
  Bottom 0.254: v16.75,96.75 9.5,96.75 2.5,103.75 v2.5,105.2 v2.51,105.21
N$7
  Bottom 0.889: HOLDER-3.1 21,95 21,95.5 19,97.5 19,111 21.25,113.25 21.25,114 HOLDER-2.2
OLED-RST
  Top 0.254: R3.1 42.5,71.5 42.5,67.5 LCD-1.5
  Bottom 0.254: RPI-1.21 38.5,78 37.5,77 35.5,77 35,76.5 35,69.5 40.5,69.5 42.5,67.5 LCD-1.5
PLAYER1
  Top 0.254: SW3.3 SW3.4
  Bottom 0.254: RPI-1.15 46.5,78.25 46.5,77.5 47.75,76.25 47.75,70.25 49.75,68.25 49.75,59.22 59.18,49.78 62.2,49.78 SW3.3
PLAYER2
  Top 0.254: 68.7,42 SW4.4 SW4.3
  Bottom 0.254: RPI-1.16 46.5,75.5 46.5,52.05 56.64,41.91 62.12,41.91 SW4.3
POWER-IN  (via drill 0.89)
  Top 0.889: v17,111.75 17,109.5 D1.A
  Bottom 0.889: HOLDER-1.1 21,133 21,132.38 13.25,132.38 10.67,129.79 10.67,122.04 J1.PWR 10.71,121.92 11.18,121.92 | CON1.2 11.39,113.24 12.19,114.05 12.19,120.9 11.18,121.92 | v17,111.75 17,118.89 13.97,121.92 11.18,121.92
RPI-3.3V  (via drill 0.25)
  Top 0.254: R2.2 62,82 v63.5,82 65,82 R1.2 | v42.5,86.5 42.5,80.25 43.75,79 43.75,78.5 RPI-1.17 | v47.5,91.5 v45.25,89.25
  Bottom 0.254: RPI-1.1 63.5,79 v63.5,82 64.5,83 64.5,84.25 57.25,91.5 v47.5,91.5 | v45.25,89.25 v42.5,86.5
RPI-5V  (via drill 0.51)
  Top 0.254: 70.75,117 68.35,117 JP5.2
  Top 0.508: R7.2 70.75,117 v70.75,118.5 70.75,119.25 68.25,121.75 S2.2 | RPI-1.4 61.75,75.75 64,75.75 RPI-1.2
  Bottom 0.508: v70.75,118.5 70.75,106.5 65.5,101.25 65.5,80 66,79.5 66,77 64.75,75.75 64.25,75.75 RPI-1.2
SCL1  (via drill 0.25)
  Top 0.254: R2.1 62,83.75 60.75,83.75 v60.75,81.25 61.25,80.75 71.75,80.75 71.75,76 66.11,70.36 44.96,70.36 44,69.4 44,67 41.75,64.75 LCD-2.3 41.5,65 LCD-3.3 | 16.75,42.5 16.75,40 12,40 U1.10 | 16.75,42.5 17.5,43.25 JP2.2 | 16.75,42.5 16.5,42.75 v16.5,43
  Bottom 0.254: v60.75,81.25 60.75,79.25 60,79.25 59.25,78.5 RPI-1.5 | LCD-1.3 37.75,67.25 38.75,66.25 39.5,66.25 40.75,65 41.3,65 LCD-2.3 | v16.5,43 36.75,63.25 40.12,63.25 LCD-3.3
SDA1  (via drill 0.25)
  Top 0.254: v62.5,85 62.5,85.5 63.5,85.5 65,84 R1.1 65,83.5 72.5,83.5 72.5,75.5 59,62 44.5,62 44.5,64.5 LCD-2.4 44,65 LCD-3.4 | U1.9 15.59,39.42 17.14,37.88 18.06,37.88 18.43,38.24 18.43,39.26 JP3.2 | 18.5,39.5 JP3.2 | v33.56,54.27 33.56,50.86 21.98,39.28 18.41,39.28 JP3.2
  Bottom 0.254: v62.5,85 62.5,78.5 62,78.5 RPI-1.3 | LCD-1.4 40.25,67.25 41.5,66 43,66 44,65 LCD-2.4 44,64.5 43.79,64.5 v33.56,54.27
SELECT
  Top 0.254: RPI-1.38 18.5,75.5 14.5,71.5 14.5,50 4.5,40 4.5,30 6.96,27.54 6.86,27.43 6.86,23.88 17.05,13.68 SW1.3 SW1.4
START
  Top 0.254: SW2.3 SW2.4
  Bottom 0.254: RPI-1.37 18.5,78.5 17.5,79.5 15,79.5 14,78.5 14,31.55 16.22,29.33 17.91,29.33 18.99,28.25 18.99,23.31 26.44,15.86 | 24.16,17.99 26.29,15.86 26.44,15.86 | 26.44,15.86 35.93,15.86 SW2.3
VIN  (via drill 0.89)
  Top 0.254: 29.5,100.75 R4.1
  Top 0.889: v27.25,100.75 29.5,100.75 Q1.2 | v21.25,106.75 21.25,109.25 D1.C
  Bottom 0.889: v21.25,106.75 v27.25,100.75
X
  Top 0.254: SW7.3 SW7.4
  Bottom 0.254: RPI-1.36 21,75.5 21,48.5 15.5,43 15.5,36 47.5,36 62,21.5 SW7.3
Y
  Top 0.254: RPI-1.33 23.5,78 22.5,77 14,77 14,50.5 2,38.5 2,26 16,12 53.73,12 SW6.3 SW6.4

### Text on the board
Top: BlueHat-2018-V2.3A 01-2018
Bottom: Guy Shalev
tPlace: RPI Power | Power | PLAYER1 | PLAYER2 | X | SELECT | START | A | Y | B